# Altium schematic sheet GigabitEthernet_VSC8211.SchDoc: GigabitEthernet_VSC8211
size A2; Organization: Altium Limited.; Address1: Level 3, 12a Rodborough Rd; Address2: Frenchs Forest 2086; Address3: NSW; Address4: AUSTRALIA; SheetNumber: 1; SheetTotal: 100
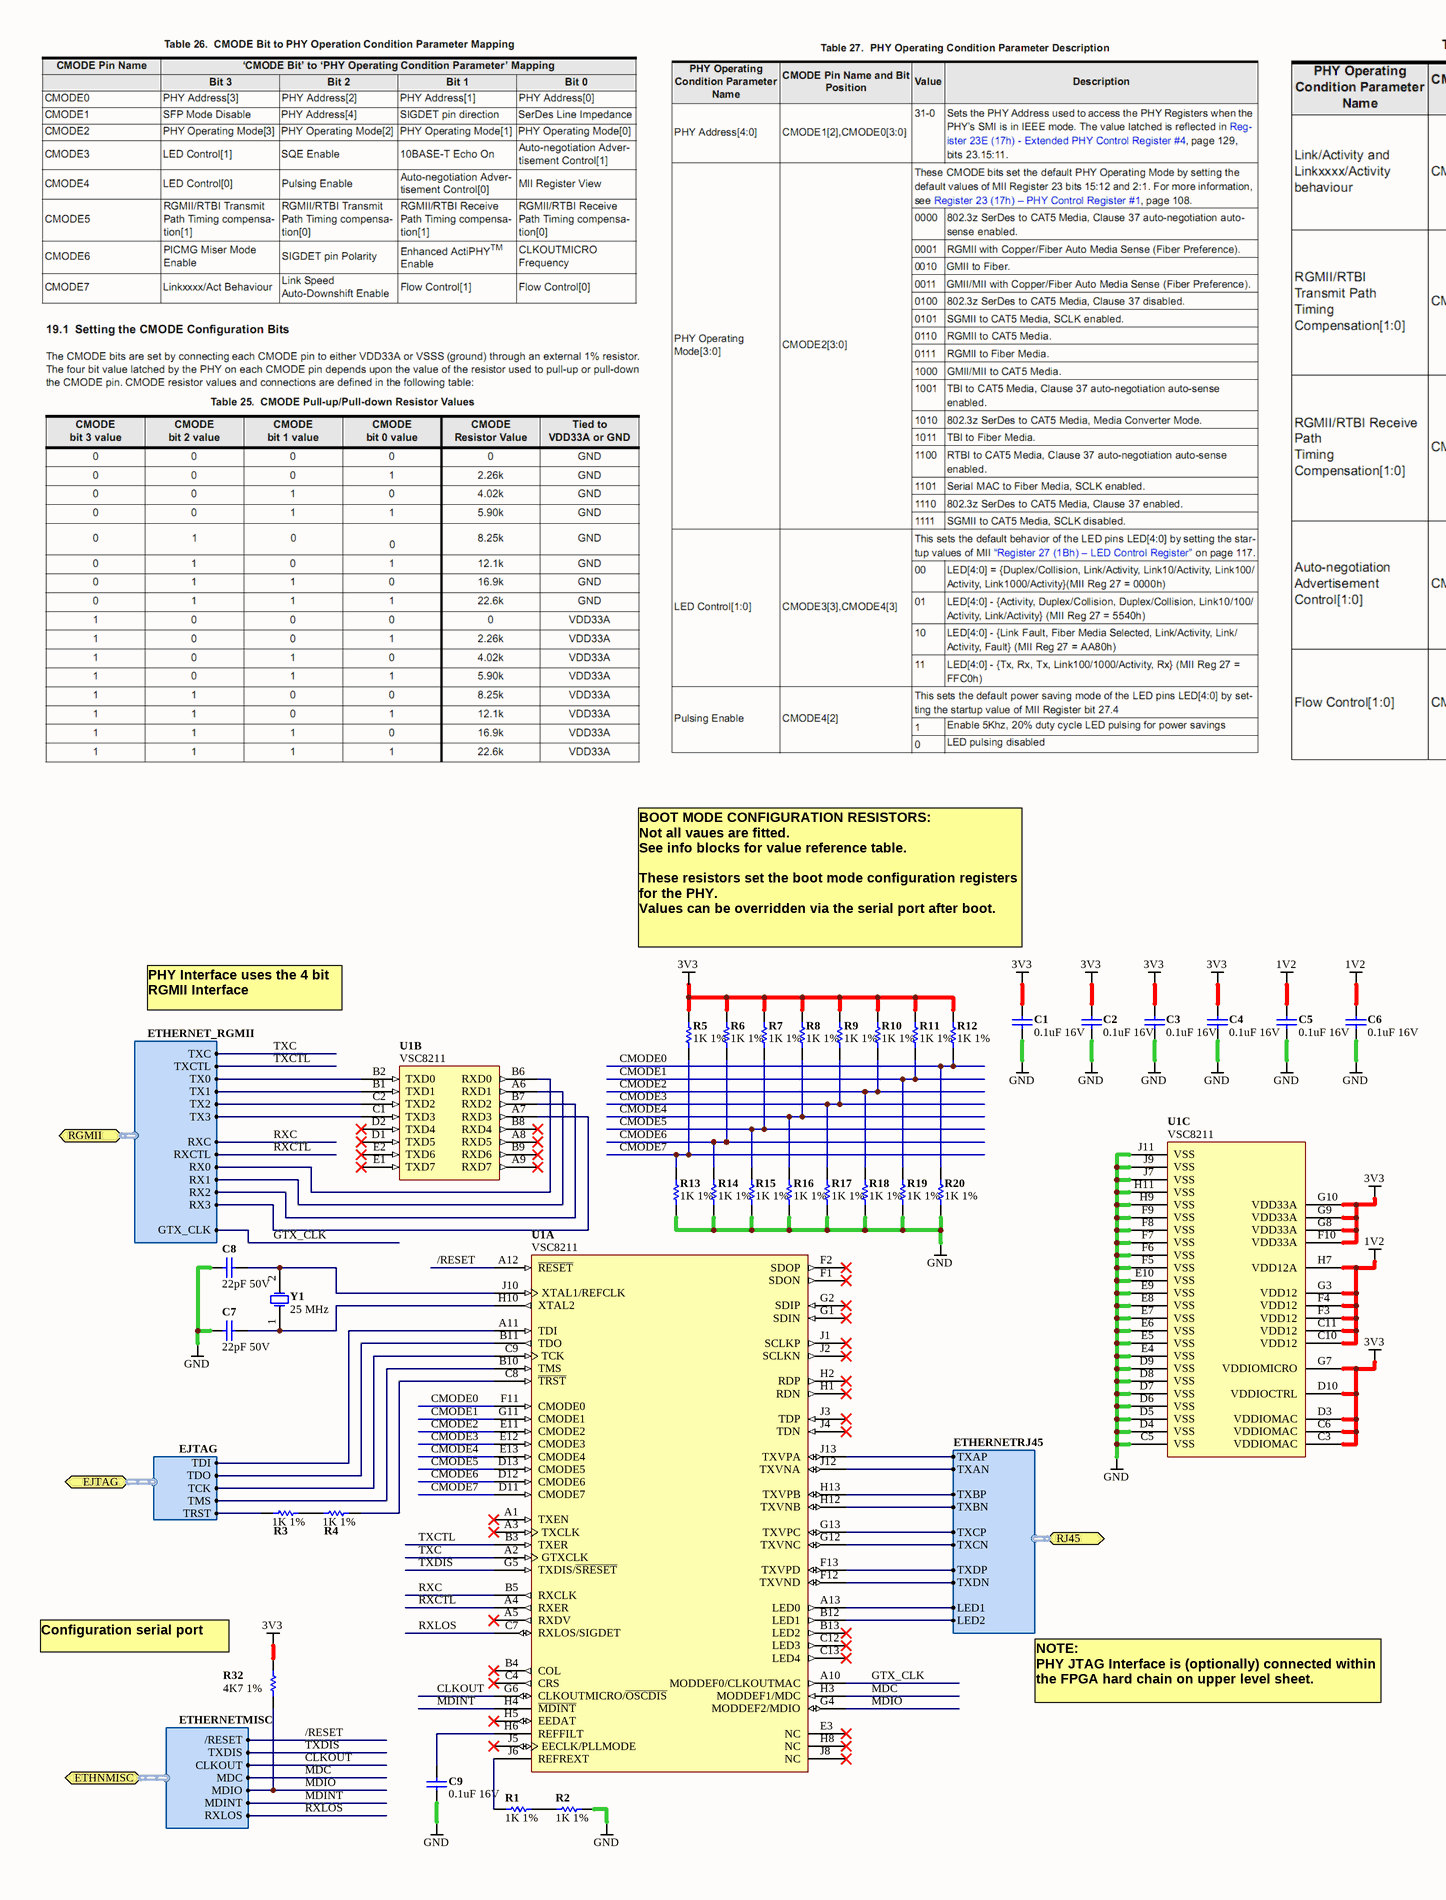
[diagram p0: GigabitEthernet_VSC8211.SchDoc, left]
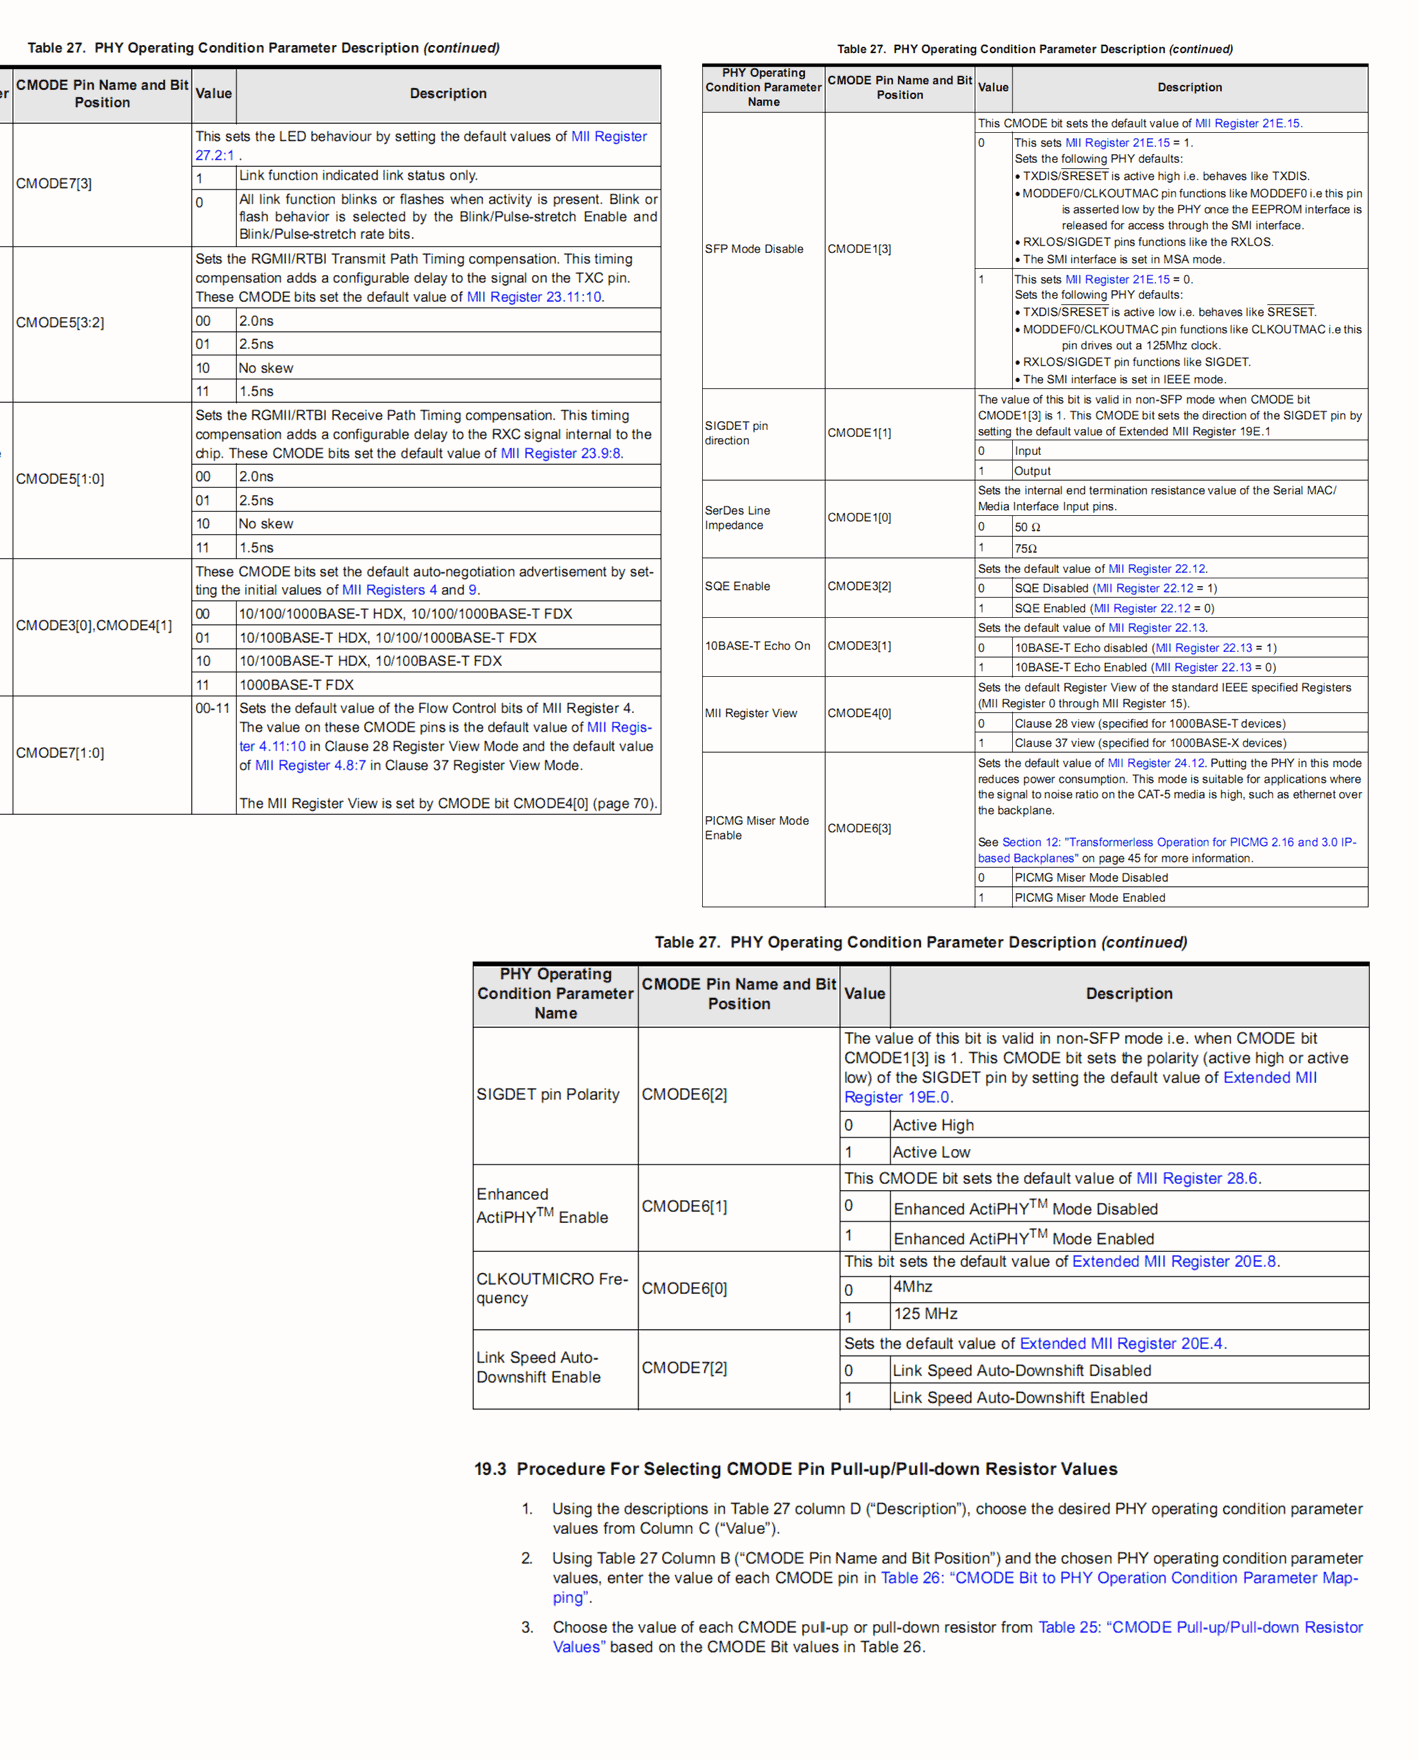
[diagram p1: GigabitEthernet_VSC8211.SchDoc, right]

## Parts
C1  0.1uF 16V  [CAPC1005-STAR]
C2  0.1uF 16V  [CAPC1005-STAR]
C3  0.1uF 16V  [CAPC1005-STAR]
C4  0.1uF 16V  [CAPC1005-STAR]
C5  0.1uF 16V  [CAPC1005-STAR]
C6  0.1uF 16V  [CAPC1005-STAR]
C7  22pF 50V  [CAPC1005-STAR]
C8  22pF 50V  [CAPC1005-STAR]
C9  0.1uF 16V  [CAPC1005-STAR]
R1  1K 1%  [RESC1005-STAR]
R2  1K 1%  [RESC1005-STAR]
R3  1K 1%  [RESC1005-STAR]
R4  1K 1%  [RESC1005-STAR]
R5  1K 1%  [RESC1005-STAR]
R6  1K 1%  [RESC1005-STAR]
R7  1K 1%  [RESC1005-STAR]
R8  1K 1%  [RESC1005-STAR]
R9  1K 1%  [RESC1005-STAR]
R10  1K 1%  [RESC1005-STAR]
R11  1K 1%  [RESC1005-STAR]
R12  1K 1%  [RESC1005-STAR]
R13  1K 1%  [RESC1005-STAR]
R14  1K 1%  [RESC1005-STAR]
R15  1K 1%  [RESC1005-STAR]
R16  1K 1%  [RESC1005-STAR]
R17  1K 1%  [RESC1005-STAR]
R18  1K 1%  [RESC1005-STAR]
R19  1K 1%  [RESC1005-STAR]
R20  1K 1%  [RESC1005-STAR]
R32  4K7 1%  [RESC1005-STAR]
U1  VSC8211  [BGA117C100P9X13_1000X1400X170]  (parts A,B,C of 3)
Y1  25 MHz  [XTAL_HC49SMD]

## Ports
EJTAG (harness EJTAG), ETHNMISC (harness ETHERNETMISC), RGMII (harness ETHERNET_RGMII), RJ45 (harness ETHERNETRJ45)

## Harnesses
ETHERNET_RGMII: RXC, RXCTL, RX0, RX1, RX2, RX3, TXC, TXCTL, TX0, TX1, TX2, TX3, GTX_CLK
ETHERNETMISC: /RESET, TXDIS, CLKOUT, MDC, MDIO, MDINT, RXLOS
ETHERNETRJ45: TXDP, TXDN, TXCP, TXCN, TXBP, TXBN, TXAP, TXAN, LED1, LED2
EJTAG: TCK, TDI, TDO, TMS, TRST

## Nets
1V2: C5.1 C6.1 U1.C10(VDD12) U1.C11(VDD12) U1.F3(VDD12) U1.F4(VDD12) U1.G3(VDD12) U1.H7(VDD12A)
3V3: C1.1 C2.1 C3.1 C4.1 R5.2 R6.2 R7.2 R8.2 R9.2 R10.2 R11.2 R12.2 R32.2 U1.C3(VDDIOMAC) U1.C6(VDDIOMAC) U1.D3(VDDIOMAC) U1.D10(VDDIOCTRL) U1.F10(VDD33A) U1.G7(VDDIOMICRO) U1.G8(VDD33A) U1.G9(VDD33A) U1.G10(VDD33A)
GND: C1.2 C2.2 C3.2 C4.2 C5.2 C6.2 C7.2 C8.2 C9.2 R2.2 R13.1 R14.1 R15.1 R16.1 R17.1 R18.1 R19.1 R20.1 U1.C5(VSS) U1.D4(VSS) U1.D5(VSS) U1.D6(VSS) U1.D7(VSS) U1.D8(VSS) U1.D9(VSS) U1.E4(VSS) U1.E5(VSS) U1.E6(VSS) U1.E7(VSS) U1.E8(VSS) U1.E9(VSS) U1.E10(VSS) U1.F5(VSS) U1.F6(VSS) U1.F7(VSS) U1.F8(VSS) U1.F9(VSS) U1.H9(VSS) U1.H11(VSS) U1.J7(VSS) U1.J9(VSS) U1.J11(VSS)
/RESET: U1.A12(~{RESET}) ; port ETHNMISC./RESET
CLKOUT: U1.G6(CLKOUTMICRO/~{OSCDIS}) ; port ETHNMISC.CLKOUT
CMODE0: R12.1 R20.2 U1.F11(CMODE0)
CMODE1: R11.1 R19.2 U1.G11(CMODE1)
CMODE2: R10.1 R18.2 U1.E11(CMODE2)
CMODE3: R9.1 R17.2 U1.E12(CMODE3)
CMODE4: R8.1 R16.2 U1.E13(CMODE4)
CMODE5: R7.1 R15.2 U1.D13(CMODE5)
CMODE6: R6.1 R14.2 U1.D12(CMODE6)
CMODE7: R5.1 R13.2 U1.D11(CMODE7)
GTX_CLK: U1.A10(MODDEF0/CLKOUTMAC) ; port RGMII.GTX_CLK
MDC: U1.H3(MODDEF1/MDC) ; port ETHNMISC.MDC
MDINT: U1.H4(~{MDINT}) ; port ETHNMISC.MDINT
MDIO: R32.1 U1.G4(MODDEF2/MDIO) ; port ETHNMISC.MDIO
RXC: U1.B5(RXCLK) ; port RGMII.RXC
RXCTL: U1.A4(RXER) ; port RGMII.RXCTL
RXLOS: U1.C7(RXLOS/SIGDET) ; port ETHNMISC.RXLOS
TXC: U1.A2(GTXCLK) ; port RGMII.TXC
TXCTL: U1.B3(TXER) ; port RGMII.TXCTL
TXDIS: U1.G5(TXDIS/~{SRESET}) ; port ETHNMISC.TXDIS
NetC7_1: C7.1 U1.H10(XTAL2) Y1.1(OSC1)
NetC8_1: C8.1 U1.J10(XTAL1/REFCLK) Y1.2(OSC2)
NetC9_1: C9.1 U1.H6(REFFILT)
NetR1_1: R1.1 U1.J6(REFREXT)
NetR1_2: R1.2 R2.1
NetR3_1: R3.1 ; port EJTAG.TRST
NetR3_2: R3.2 R4.1
NetR4_2: R4.2 U1.C8(~{TRST})
NetU1_A6: U1.A6(RXD1) ; port RGMII.RX1
NetU1_A7: U1.A7(RXD3) ; port RGMII.RX3
NetU1_A11: U1.A11(TDI) ; port EJTAG.TDI
NetU1_A13: U1.A13(LED0) ; port RJ45.LED1
NetU1_B1: U1.B1(TXD1) ; port RGMII.TX1
NetU1_B2: U1.B2(TXD0) ; port RGMII.TX0
NetU1_B6: U1.B6(RXD0) ; port RGMII.RX0
NetU1_B7: U1.B7(RXD2) ; port RGMII.RX2
NetU1_B10: U1.B10(TMS) ; port EJTAG.TMS
NetU1_B11: U1.B11(TDO) ; port EJTAG.TDO
NetU1_B12: U1.B12(LED1) ; port RJ45.LED2
NetU1_C1: U1.C1(TXD3) ; port RGMII.TX3
NetU1_C2: U1.C2(TXD2) ; port RGMII.TX2
NetU1_C9: U1.C9(TCK) ; port EJTAG.TCK
NetU1_F12: U1.F12(TXVND) ; port RJ45.TXDN
NetU1_F13: U1.F13(TXVPD) ; port RJ45.TXDP
NetU1_G12: U1.G12(TXVNC) ; port RJ45.TXCN
NetU1_G13: U1.G13(TXVPC) ; port RJ45.TXCP
NetU1_H12: U1.H12(TXVNB) ; port RJ45.TXBN
NetU1_H13: U1.H13(TXVPB) ; port RJ45.TXBP
NetU1_J12: U1.J12(TXVNA) ; port RJ45.TXAN
NetU1_J13: U1.J13(TXVPA) ; port RJ45.TXAP

Not connected (* = marked no-connect by the designer): U1 A1(TXEN)* A3(TXCLK)* A5(RXDV)* A8(RXD5)* A9(RXD7)* B4(COL)* B8(RXD4)* B9(RXD6)* B13(LED2)* C4(CRS)* C12(LED3)* C13(LED4)* D1(TXD5)* D2(TXD4)* E1(TXD7)* E2(TXD6)* E3(NC)* F1(SDON)* F2(SDOP)* G1(SDIN)* G2(SDIP)* H1(RDN)* H2(RDP)* H5(EEDAT)* H8(NC)* J1(SCLKP)* J2(SCLKN)* J3(TDP)* J4(TDN)* J5(EECLK/PLLMODE)* J8(NC)*

## Notes on the sheet
- BOOT MODE CONFIGURATION RESISTORS:
  Not all vaues are fitted.
  See info blocks for value reference table.
  These resistors set the boot mode configuration registers for the PHY.
  Values can be overridden via the serial port after boot.
- PHY Interface uses the 4 bit RGMII Interface
- (near R32) Configuration serial port
- NOTE:
  PHY JTAG Interface is (optionally) connected within the FPGA hard chain on upper level sheet.
- Project Title
- Sheet Title
- Size:
- Date:
- File:
- A2
- Assy:
- Time:
- Revision:
- Sheet
- of

## Library data of the parts
C1-C6 C9 = D-101-0080: Capacitor, Ceramic, 0.1uF 10% 16V 0402 (1005) X7R; Polarity: Non-Polarized; Category: Capacitor; Capacitance: 0.1 uF; Dielectric: X7R; Mounting Technology: Surface Mount; Rated Voltage: 16 V; Status: Production; Technology: Ceramic; Tolerance: 10 %
C7 C8 = D-101-0059: Capacitor, Ceramic, 22pF 5% 50V 0402 (1005) COG; Polarity: Non-Polarized; Capacitance: 22 pF; Dielectric: COG; Mounting Technology: Surface Mount; Rated Voltage: 50 V; Status: Unreleased; Technology: Ceramic; Tolerance: 5 %; Category: Capacitor
R1-R20 = D-100-0121: Resistor, 1K 1% 0402 (1005); Power Rating: 63 mW; Mounting Technology: Surface Mount; Resistance: 1 K; Status: Production; Tolerance: 1 %; Category: Resistor
R32 = D-100-0088: Resistor, 4K7 1% 0402 (1005); Power Rating: 63 mW; Resistance: 4.7 K; Mounting Technology: Surface Mount; Status: Production; Tolerance: 1 %; Category: Resistor
U1 = D-221-0014: Ethernet PHY, Gigabit, Vitesse, VSC8211; Comm Standard: CAN; Mounting Technology: Surface Mount; Status: Production; Category: IC-Communication
Y1 = D-103-0003: Crystal, 25 MHz  +/-30ppm 20pf HC49SMD; Frequency Stability: 30 ppm; Nominal Operational Voltage: mV; Frequency Tolerance: 30 ppm; Load Capacitance: 20 pF; Mounting Technology: Surface Mount; Nominal Fequency: 25 MHz; Status: Production; Category: Crystal